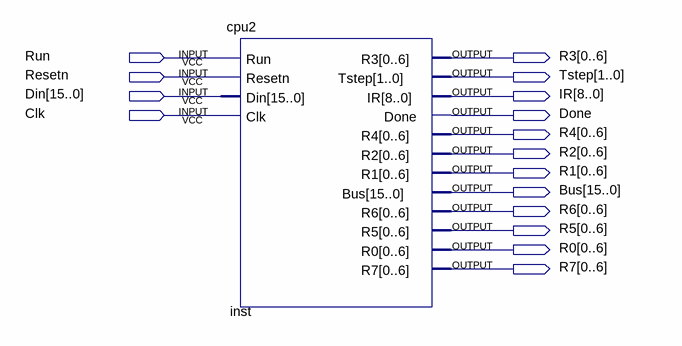
[diagram p0: schematic sheet]
// Quartus schematic part1.bdf as structural Verilog: 1 symbols, 16 pins
module part1 (
  input  Run,
  input  Resetn,
  input  [15:0] Din,
  input  Clk,
  output [0:6] R3,
  output [1:0] Tstep,
  output [8:0] IR,
  output Done,
  output [0:6] R4,
  output [0:6] R2,
  output [0:6] R1,
  output [15:0] Bus,
  output [0:6] R6,
  output [0:6] R5,
  output [0:6] R0,
  output [0:6] R7
);

  cpu2 inst (
    .Run(Run), .Resetn(Resetn), .Din(Din), .Clk(Clk), .R3(R3), .Tstep(Tstep), .IR(IR), .Done(Done), .R4(R4),
    .R2(R2), .R1(R1), .Bus(Bus), .R6(R6), .R5(R5), .R0(R0), .R7(R7));
endmodule
